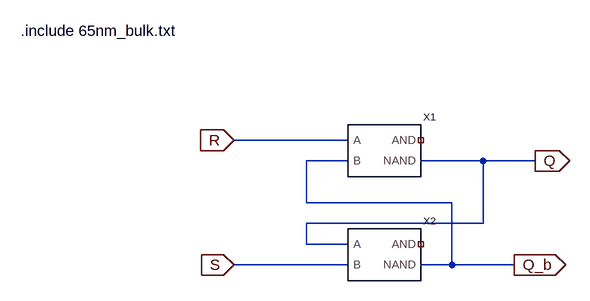
[diagram p0: schematic nand_latch.asc]
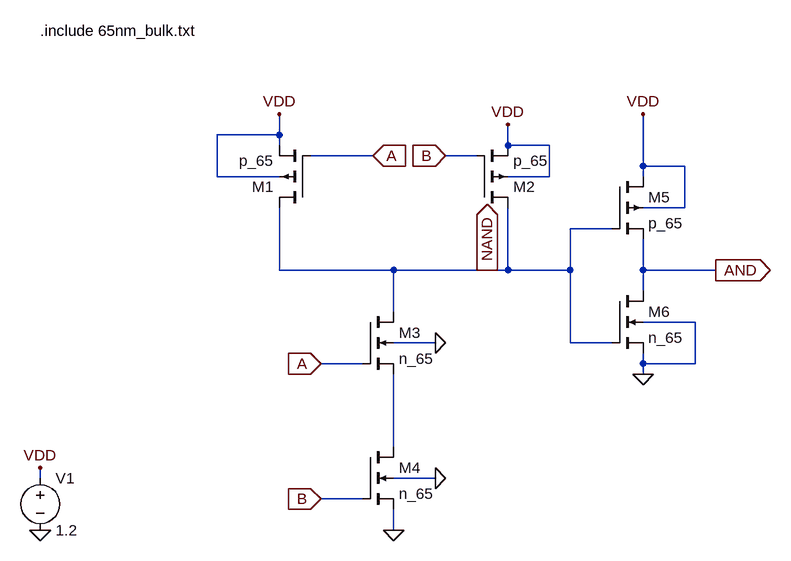
[diagram p1: sub-circuit nand.asc]
nand_latch.asc, the LTspice schematic file:
Version 4
SHEET 1 880 680
WIRE 384 224 208 224
WIRE 384 256 320 256
WIRE 592 256 496 256
WIRE 672 256 592 256
WIRE 320 320 320 256
WIRE 544 320 320 320
WIRE 592 352 592 256
WIRE 592 352 320 352
WIRE 320 384 320 352
WIRE 384 384 320 384
WIRE 384 416 208 416
WIRE 544 416 544 320
WIRE 544 416 496 416
WIRE 640 416 544 416
FLAG 672 256 Q
IOPIN 672 256 Out
FLAG 640 416 Q_b
IOPIN 640 416 Out
FLAG 208 224 R
IOPIN 208 224 In
FLAG 208 416 S
IOPIN 208 416 In
SYMBOL nand 432 240 R0
SYMATTR InstName X1
SYMBOL nand 432 400 R0
SYMATTR InstName X2
TEXT -120 56 Left 2 !.include 65nm_bulk.txt

nand.asc, the sub-circuit schematic file:
Version 4
SHEET 1 1500 944
WIRE 560 224 560 192
WIRE 560 224 464 224
WIRE 560 240 560 224
WIRE 912 240 912 208
WIRE 976 240 912 240
WIRE 704 256 608 256
WIRE 864 256 816 256
WIRE 1120 272 1120 192
WIRE 1184 272 1120 272
WIRE 464 288 464 224
WIRE 560 288 464 288
WIRE 976 288 976 240
WIRE 976 288 912 288
WIRE 1120 288 1120 272
WIRE 1184 336 1184 272
WIRE 1184 336 1120 336
WIRE 1072 368 1008 368
WIRE 560 432 560 336
WIRE 736 432 560 432
WIRE 880 432 736 432
WIRE 912 432 912 336
WIRE 912 432 880 432
WIRE 1008 432 1008 368
WIRE 1008 432 912 432
WIRE 1120 432 1120 384
WIRE 1232 432 1120 432
WIRE 1120 464 1120 432
WIRE 736 496 736 432
WIRE 1200 512 1120 512
WIRE 800 544 736 544
WIRE 1008 544 1008 432
WIRE 1072 544 1008 544
WIRE 688 576 624 576
WIRE 1120 576 1120 560
WIRE 1200 576 1200 512
WIRE 1200 576 1120 576
WIRE 1120 592 1120 576
WIRE 736 704 736 592
WIRE 192 752 192 736
WIRE 800 752 736 752
WIRE 688 784 624 784
WIRE 736 832 736 800
FLAG 1232 432 AND
IOPIN 1232 432 Out
FLAG 192 832 0
FLAG 1120 592 0
FLAG 880 432 NAND
IOPIN 880 432 Out
FLAG 704 256 A
IOPIN 704 256 In
FLAG 816 256 B
IOPIN 816 256 In
FLAG 624 576 A
IOPIN 624 576 In
FLAG 624 784 B
IOPIN 624 784 In
FLAG 800 544 0
FLAG 800 752 0
FLAG 736 832 0
FLAG 192 736 VDD
FLAG 560 192 VDD
FLAG 912 208 VDD
FLAG 1120 192 VDD
SYMBOL pmos4 608 336 R180
SYMATTR InstName M1
SYMATTR Value p_65
SYMATTR Value2 l=65n w=2u
SYMBOL pmos4 864 336 M180
SYMATTR InstName M2
SYMATTR Value p_65
SYMATTR Value2 l=65n w=2u
SYMBOL nmos4 688 496 R0
SYMATTR InstName M3
SYMATTR Value n_65
SYMATTR Value2 l=65n w=1u
SYMBOL nmos4 688 704 R0
SYMATTR InstName M4
SYMATTR Value n_65
SYMATTR Value2 l=65n w=1u
SYMBOL pmos4 1072 288 R0
SYMATTR InstName M5
SYMATTR Value2 l=65n w=4u
SYMATTR Value p_65
SYMBOL nmos4 1072 464 R0
SYMATTR InstName M6
SYMATTR Value2 l=65n w=2u
SYMATTR Value n_65
SYMBOL Voltage 192 736 R0
SYMATTR InstName V1
SYMATTR Value 1.2
TEXT 192 64 Left 2 !.include 65nm_bulk.txt

The netlist it stands for:
* nand_latch.asc
XX1 R Q_b NC_01 Q nand
XX2 Q S NC_02 Q_b nand

* block symbol definitions
.subckt nand A B AND NAND
M1 NAND A VDD VDD p_65 l=65n w=2u
M2 NAND B VDD VDD p_65 l=65n w=2u
M3 NAND A N001 0 n_65 l=65n w=1u
M4 N001 B 0 0 n_65 l=65n w=1u
M5 VDD NAND AND VDD p_65 l=65n w=4u
M6 AND NAND 0 0 n_65 l=65n w=2u
V1 VDD 0 1.2
.include 65nm_bulk.txt
.ends nand

.model NMOS NMOS
.model PMOS PMOS
.lib standard.mos
.include 65nm_bulk.txt
.backanno
.end